# Altium schematic sheet batt_protection.SchDoc: Battery Protection
size A4; Organization: Badgerloop; Address1: 133 Engineering Research; Address2: Building; Address3: Madison, WI 53715; SheetNumber: 17
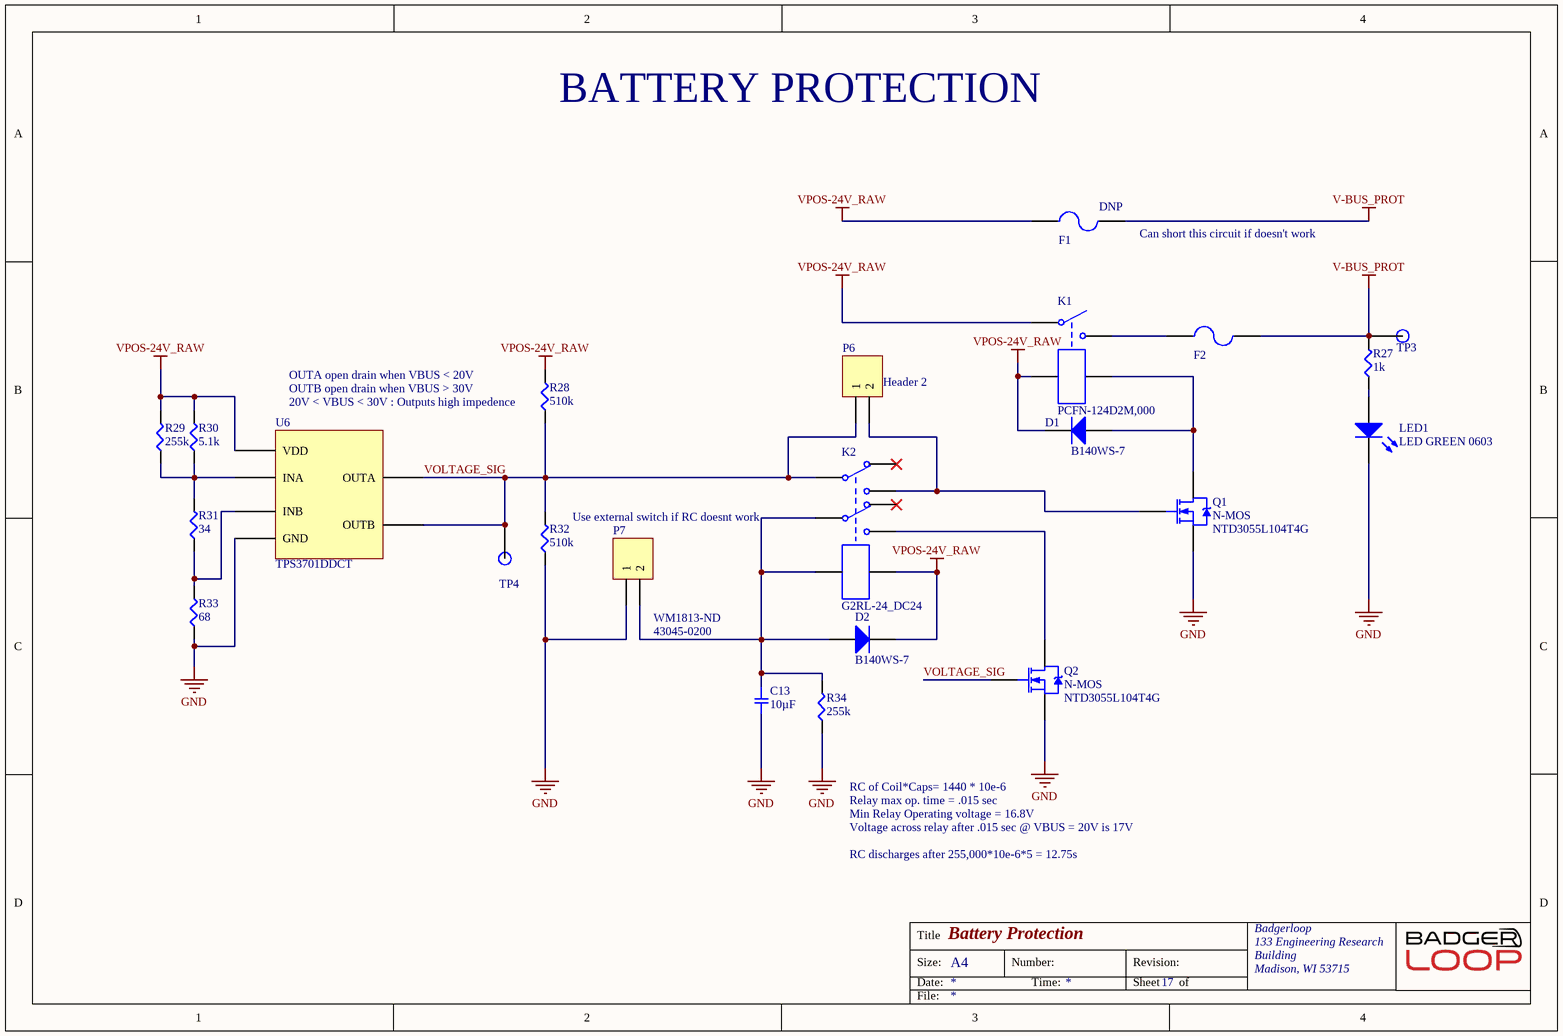
[diagram p0: batt_protection.SchDoc]

## Parts
C13  10µF  [SMD-1206C]
D1  B140WS-7  [SODFL250X110-2N]
D2  B140WS-7  [SODFL250X110-2N]
F1  3568  [Fuse Holder 30A 500V 1 Circuit Blade Through Hole]  (value not drawn)
F2  3568  [Fuse Holder 30A 500V 1 Circuit Blade Through Hole]  (value not drawn)
K1  PCFN-124D2M,000  [PCFN-124D2M,000]
K2  G2RL-24_DC24  [G2RL]
LED1  LED GREEN 0603  [LED 0603 GREEN]
P6  Header 2  [Pin Header 1x2 TH Pitch 2.54mm]
P7  43045-0200  Supplier Part Number 1: WM1813-ND  [430450200]
Q1  N-MOS  Manufacturer P/N: NTD3055L104T4G  [DPAK228P991X238-3N]
Q2  N-MOS  Manufacturer P/N: NTD3055L104T4G  [DPAK228P991X238-3N]
R27  1k  [SMD-0805-RES]
R28  510k  [SMD-0805-RES]
R29  255k  [SMD-0805-RES]
R30  5.1k  [SMD-0805-RES]
R31  34  [SMD-0805-RES]
R32  510k  [SMD-0805-RES]
R33  68  [SMD-0805-RES]
R34  255k  [SMD-0805-RES]
TP3  TP  [Test Point]  (value not drawn)
TP4  TP  [Test Point]  (value not drawn)
U6  TPS3701DDCT  [TSOP95P280X110-6N]

## Nets
GND: C13.2 LED1.2(K) P7.1 Q1.3(S) Q2.3(S) R32.1 R33.1 R34.1 U6.2(GND)
V-BUS_PROT: F1.2 F2.2 R27.2 TP3.1
VPOS-24V_RAW: D1.2(K) D2.2(K) F1.1 K1.1 K1.3 K2.8 R28.2 R29.2 R30.2 U6.5(VDD)
VOLTAGE_SIG: K2.3 P6.1 Q2.1(G) R28.1 R32.2 TP4.1 U6.1(OUTA) U6.6(OUTB)
NetC13_1: C13.1 D2.1(A) K2.1 K2.6 P7.2 R34.2
NetD1_1: D1.1(A) K1.2 Q1.4(D)
NetF2_1: F2.1 K1.4
NetK2_4: K2.4 P6.2 Q1.1(G)
NetK2_5: K2.5 Q2.4(D)
NetLED1_1: LED1.1(A) R27.1
NetR29_1: R29.1 R30.1 R31.2 U6.3(INA)
NetR31_1: R31.1 R33.2 U6.4(INB)

Not connected (* = marked no-connect by the designer): K2 2* 7*

## Notes on the sheet
- BATTERY PROTECTION
- (near F1) Can short this circuit if doesn't work
- OUTA open drain when VBUS < 20V
- OUTB open drain when VBUS > 30V
- (near R28) 20V < VBUS < 30V : Outputs high impedence
- (near R32) Use external switch if RC doesnt work
- RC of Coil*Caps= 1440 * 10e-6
- Relay max op. time = .015 sec
- Voltage across relay after .015 sec @ VBUS = 20V is 17V
- Min Relay Operating voltage = 16.8V
- RC discharges after 255,000*10e-6*5 = 12.75s
- Title
- Size:
- Date:
- A4
- Number:
- Time:
- Revision:
- Sheet
- of
- File:

## Library data of the parts
C13 = GRM31CR61H106KA12L: CAP CER 10UF 50V X5R 1206; Manufacturer: Murata Electronics North America; Factory Stock: 0; Unit Price (USD): 0.65; Minimum Quantity: 1; Tolerance: ±10%; Datasheets: http://www.murata.com/~/media/webrenewal/support/library/catalog/products/capacitor/mlcc/c02e.pdf; Image: //media.digikey.com/Renders/Murata%20Renders/GR331BD72E473KW01L.jpg; Digi-Key Part Number: 490-5961-1-ND; Part Number: GRM31CR61H106KA12L; Quantity Available: 86736; @ qty: 0; Packaging: Cut Tape (CT); Series: GRM; Part Status: Active; Value: 10µF; Voltage: 50V; Temperature Coefficient: X5R; Operating Temperature: -55°C ~ 85°C; Features: -; Ratings: -; Applications: General Purpose; Mounting Type: Surface Mount, MLCC; Package / Case: 1206 (3216 Metric); Size / Dimension: 0.126" L x 0.063" W (3.20mm x 1.60mm); Height - Seated (Max): -; Thickness (Max): 0.071" (1.80mm); Lead Spacing: -; Lead Style: -
D1 D2 = B140WS-7: Diode Schottky 40V 1A 2-Pin SOD-323 T/R; Manufacturer: Diodes; Max Reverse Current: 50uA; Peak Non-Repetitive Surge Current: 3A; Element Configuration: Single; Forward Voltage: 620mV; Natural Thermal Resistance: 426°C/W; Supplier 1: Digi-Key; Stock 1: 38792; Pricing 1: 1=0.41, 10=0.293, 100=0.1476, 500=0.13076, 1000=0.10176 (USD); Mount: Surface Mount; Number of Pins: 2; Weight: 0.000173oz; Contact Plating: Tin,Matte; Min Operating Temperature: -40°C; Max Operating Temperature: 125°C; Forward Current: 1A; Max Repetitive Reverse Voltage (Vrrm): 40V; Package Quantity: 3000; Packaging: Tape and Reel; Average Rectified Current: 1A; Max Forward Surge Current (Ifsm): 3A; Max Reverse Voltage (DC): 40V; Series: -; Length: 1.8mm; Width: 1.4mm; Height: 1.1mm; RoHS Compliant: Yes; ComponentLink1URL: http://www.mouser.com/ds/2/115/ds31543-56649.pdf?src-supplier=Mouser; ComponentLink1Description: http://www.mouser.com/ds/2/115/ds31543-56649.pdf?src-supplier=Mouser; ComponentLink2URL: http://www.diodes.com//datasheets/ds31543.pdf?src-supplier=Avnet+Europe; ComponentLink2Description: http://www.diodes.com//datasheets/ds31543.pdf?src-supplier=Avnet+Europe; ComponentLink3URL: http://www.diodes.com/datasheets/ds31543.pdf?src-supplier=Digi-Key; ComponentLink3Description: http://www.diodes.com/datasheets/ds31543.pdf?src-supplier=Digi-Key; Supplier Part Number 1: B140WS-7DICT-ND
F1 F2 = 3568: FUSE HOLDER MINI AUTO PC; Manufacturer: Keystone Electronics; Material: Brass,Tin,Nylon; Color: Black; Body Material: Nylon; Current Rating: 20A; Voltage Rating (AC): 500V; Number of Poles: 1; Illumination Type: Illuminated; Fuse Type: Automotive; Approvals: UL; Supplier 1: Digi-Key; Manufacturer Part Number: 3568; Stock 1: 0; Mount: PCB,Vertical; Contact Material: Brass,Tin; Contact Plating: Tin; Min Operating Temperature: -50°C; Max Operating Temperature: 145°C; Package Quantity: 1; Termination: PC Pin; Orientation: Vertical; Number of Circuits: 1; Voltage: 500V; Fuse Current: 20A; Length: 16mm; Depth: 6.73mm; Lead Free: Lead Free; REACH SVHC: No SVHC; Flammability Rating: UL94 V-0; ComponentLink1URL: http://www.keyelco.com/userAssets/file/M60-2p40.pdf?src-supplier=Future+Electronics; ComponentLink1Description: http://www.keyelco.com/userAssets/file/M60-2p40.pdf?src-supplier=Future+Electronics; ComponentLink2URL: https://www.alliedelec.com/m/d/15b4f09b8ba48c4b08efedd730709c21.pdf?src-supplier=Allied+Electronics; ComponentLink2Description: https://www.alliedelec.com/m/d/15b4f09b8ba48c4b08efedd730709c21.pdf?src-supplier=Allied+Electronics; Supplier Part Number 1: 3568K-ND
  F1: DNP: DNP
K1 = PCFN-124D2M,000: RELAY, PCB, SPST-NO, 24VDC, 25A; Manufacturer: TE Connectivity; Coil Current: 37.5mA; Throw Configuration: SPST; Coil Resistance: 640R; Operate Time: 20ms; Release Time: 10ms; Coil Power: 1W; Relay Type: General Purpose; Coil Type: Non-Latching; Coil Voltage (DC): 24V; Contact Voltage Rating (AC): 277V; Approvals: UL,VDE; Supplier 1: Digi-Key; Stock 1: 401; Pricing 1: 1=3.7, 10=3.473, 25=3.0872, 50=2.9326, 100=2.7783, 250=2.4696, 500=2.31526, 1000=2.1609 (USD); Mount: Through Hole,PCB; Weight: 28g; Contact Material: Tin,Silver; Min Operating Temperature: -30°C; Max Operating Temperature: 55°C; Contact Current Rating: 25A; Termination: PCB; Package Quantity: 500; Packaging: Rail/Tube; Current Rating: 25A; Voltage Rating (DC): 24V; Length: 30.4mm; Height: 1.043inch; Depth: 16mm; Width: 0.63inch; REACH SVHC: Unknown; ELV: Compliant; ComponentLink1URL: http://www.farnell.com/cad/1652771.pdf?src-supplier=Element14; ComponentLink1Description: http://www.farnell.com/cad/1652771.pdf?src-supplier=Element14; ComponentLink2URL: http://www.farnell.com/datasheets/2043483.pdf?src-supplier=Farnell; ComponentLink2Description: http://www.farnell.com/datasheets/2043483.pdf?src-supplier=Farnell; Supplier Part Number 1: PB2178-ND; ComponentLink3Description: https://www.te.com/commerce/DocumentDelivery/DDEController?Action=srchrtrv&DocNm=PCFN_solar_relay_datasheet&DocType=DS&DocLang=English; ComponentLink3URL: https://www.te.com/commerce/DocumentDelivery/DDEController?Action=srchrtrv&DocNm=PCFN_solar_relay_datasheet&DocType=DS&DocLang=English
K2 = G2RL-24_DC24: RELAY GEN PURPOSE DPDT 8A 24V; Manufacturer: Omron; Manufacturer Part Number: G2RL-24-DC24; Voltage Rating (AC): 440V; Voltage Rating (DC): 300V; Power Consumption: 400mW; Coil Resistance: 1.44kR; Coil Current: 16.7mA; Operate Time: 15ms; Coil Type: Non-Latching; Relay Type: General Purpose; Release Time: 5ms; Supplier 1: Digi-Key; Stock 1: 13387; Pricing 1: 1=4.32, 10=4.053, 25=3.6028, 50=3.4226, 100=3.2425, 250=2.88224, 500=2.7021 (USD); Mount: Through Hole; Case/Package: DIP; Number of Pins: 8; Weight: 12g; Contact Material: Silver,Cadmium; Min Operating Temperature: -40°C; Max Operating Temperature: 85°C; Max Current Rating: 8A; Packaging: Bulk; Max Voltage Rating (AC): 440V; Max Voltage Rating (DC): 300V; Package Quantity: 20; Throw Configuration: DPDT; Termination: PC Pin; Contact Current Rating: 8A; Coil Voltage (DC): 24V; Coil Power: 400mW; Power Rating: 400mW; Length: 29mm; Height: 15.7mm; Width: 12.7mm; Depth: 12.7mm; Radiation Hardening: No; Lead Free: Lead Free; ComponentLink1URL: http://www.alliedelec.com/images/products/datasheets/bm/OMRON_ELECTRONICS_LLC/70175264.pdf?src-supplier=Allied+Electronics; ComponentLink1Description: http://www.alliedelec.com/images/products/datasheets/bm/OMRON_ELECTRONICS_LLC/70175264.pdf?src-supplier=Allied+Electronics; ComponentLink2URL: http://www.mouser.com/ds/2/307/en-g2rl-472571.pdf?src-supplier=Mouser; ComponentLink2Description: http://www.mouser.com/ds/2/307/en-g2rl-472571.pdf?src-supplier=Mouser
LED1 = LED GREEN 0603: Manufacturer: Lite-On Inc.; Manufacturer P/N: LTST-C190KGKT; Digikey P/N: 160-1435-1-ND; Package / Case: 0603; Color: GREEN
P6 = Header 2: Header, 2-Pin; LatestRevisionDate: 17-Jul-2002; LatestRevisionNote: Re-released for DXP Platform.; Publisher: Altium Limited
P7 = 43045-0200: CONN HEADER R/A 2POS; Manufacturer: Molex; Contact Resistance: 10mR; Number of Contacts: 2; Voltage Rating: 600V; Current Rating: 5A; Gender: Male; Max Voltage Rating (DC): 250.25kV; Voltage Rating (DC): 250V; Insulation Resistance: 1GR; Pitch: 3mm; Glow Wire Compliant: Compliant; Approvals: UL,CSA,TUV; Supplier 1: Digi-Key; Manufacturer Part Number: 43045-0200; Stock 1: 6320; Pricing 1: 1=0.97000, 10=0.84900, 100=0.73280, 500=0.59958, 1000=0.53296, 5000=0.46634, 10000=0.44302 (USD); RoHS: Yes; Mount: Through Hole; Case/Package: SMC; Contact Plating: Tin; Color: Black; Contact Material: Brass,Tin; Housing Color: Black; Housing Material: Thermoplastic; Material: Thermoplastic; Min Operating Temperature: -40°C; Max Operating Temperature: 105°C; Termination: Through Hole; Number of Rows: 2; Orientation: Right Angle; Packaging: Tray; Number of Positions: 2; Package Quantity: 3168; Number of Circuits: 2; Contact Gender: Male; Diameter: 3mm; Row Spacing: 3mm; Radiation Hardening: No; Flammability Rating: UL94 V-0; REACH SVHC: Unknown; Lead Free: Lead Free; Halogen Free: Low Halogen; ComponentLink1URL: https://datasheet.ciiva.com/14155/04402310-14155203.pdf?src-supplier=Distrelec; ComponentLink1Description: https://datasheet.ciiva.com/14155/04402310-14155203.pdf?src-supplier=Distrelec; ComponentLink2URL: https://datasheet.ciiva.com/19454/883270-19454006.pdf?src-supplier=Jameco; ComponentLink2Description: https://datasheet.ciiva.com/19454/883270-19454006.pdf?src-supplier=Jameco; ComponentLink3URL: https://datasheet.ciiva.com/5150/0430450200-pcb-headers-145770-5150407.pdf?src-supplier=Mouser; ComponentLink3Description: https://datasheet.ciiva.com/5150/0430450200-pcb-headers-145770-5150407.pdf?src-supplier=Mouser; ComponentLink4URL: https://datasheet.ciiva.com/11747/0900766b80027348-11747001.pdf?src-supplier=RSComponents; ComponentLink4Description: https://datasheet.ciiva.com/11747/0900766b80027348-11747001.pdf?src-supplier=RSComponents; ComponentLink5URL: https://datasheet.ciiva.com/16656/0430450200-pcb-headers-16656330.pdf?src-supplier=Avnet+Europe; ComponentLink5Description: https://datasheet.ciiva.com/16656/0430450200-pcb-headers-16656330.pdf?src-supplier=Avnet+Europe; ComponentLink6URL: https://datasheet.ciiva.com/10090/0430450200-pcb-headers-10090299.pdf?src-supplier=Avnet; ComponentLink6Description: https://datasheet.ciiva.com/10090/0430450200-pcb-headers-10090299.pdf?src-supplier=Avnet; ComponentLink7URL: https://datasheet.ciiva.com/36854/124280430450200-pcb-headers-36854331.pdf?src-supplier=Onlinecomponents.com; ComponentLink7Description: https://datasheet.ciiva.com/36854/124280430450200-pcb-headers-36854331.pdf?src-supplier=Onlinecomponents.com; ComponentLink8URL: https://datasheet.ciiva.com/1443/1859921-1443437.pdf?src-supplier=Element14; ComponentLink8Description: https://datasheet.ciiva.com/1443/1859921-1443437.pdf?src-supplier=Element14
Q1 Q2 = N-MOS: N-Channel Power MOSFET, 12 A, 60 V; Manufacturer: ON SEMI; Digikey Link: https://www.digikey.com/product-detail/en/on-semiconductor/NTD3055L104T4G/NTD3055L104T4GOSDKR-ND/1749196; Digikey P/N: NTD3055L104T4GOSDKR-ND
R27 = ERJ-P06J102V: RES SMD 1K OHM 5% 1/2W 0805; Manufacturer: Panasonic Electronic Components; Factory Stock: 0; Unit Price (USD): 0.01839; @ qty: 1500; Minimum Quantity: 1; Power (Watts): 0.5W, 1/2W; Temperature Coefficient: ±200ppm/°C; Part Number: ERJ-P06J102V; Datasheets: https://industrial.panasonic.com/cdbs/www-data/pdf/RDA0000/AOA0000C243.pdf; Image: //media.digikey.com/Renders/Panasonic%20Renders/ERJ-0805%20Pkg.jpg; Digi-Key Part Number: P1.0KADCT-ND; Quantity Available: 124757; Packaging: Cut Tape (CT); Series: ERJ; Part Status: Active; Value: 1k; Tolerance: ±5%; Composition: Thick Film; Features: Automotive AEC-Q200, Pulse Withstanding; Operating Temperature: -55°C ~ 155°C; Package / Case: 0805 (2012 Metric); Supplier Device Package: 0805; Size / Dimension: 0.079" L x 0.049" W (2.00mm x 1.25mm); Height - Seated (Max): 0.028" (0.70mm); Number of Terminations: 2; Failure Rate: -
R28 R32 = ERJ-6ENF5103V: RES SMD 510K OHM 1% 1/8W 0805; Manufacturer: Panasonic Electronic Components; Factory Stock: 0; Unit Price (USD): 0.00729; @ qty: 1500; Minimum Quantity: 1; Power (Watts): 0.125W, 1/8W; Temperature Coefficient: ±100ppm/°C; Part Number: ERJ-6ENF5103V; Datasheets: http://industrial.panasonic.com/www-cgi/jvcr13pz.cgi?E+PZ+3+AOA0002+ERJ6ENF5103V+7+WW; Image: //media.digikey.com/Renders/Panasonic%20Renders/ERJ-0805%20Pkg.jpg; Digi-Key Part Number: P510KCCT-ND; Quantity Available: 23343; Packaging: Cut Tape (CT); Series: ERJ; Part Status: Active; Value: 510k; Tolerance: ±1%; Composition: Thick Film; Features: Automotive AEC-Q200; Operating Temperature: -55°C ~ 155°C; Package / Case: 0805 (2012 Metric); Supplier Device Package: 0805; Size / Dimension: 0.079" L x 0.049" W (2.00mm x 1.25mm); Height - Seated (Max): 0.028" (0.70mm); Number of Terminations: 2; Failure Rate: -
R29 R34 = ERJ-6ENF2553V: RES SMD 255K OHM 1% 1/8W 0805; Manufacturer: Panasonic Electronic Components; Factory Stock: 0; Unit Price (USD): 0.00729; @ qty: 1500; Minimum Quantity: 1; Power (Watts): 0.125W, 1/8W; Temperature Coefficient: ±100ppm/°C; Part Number: ERJ-6ENF2553V; Datasheets: http://industrial.panasonic.com/www-cgi/jvcr13pz.cgi?E+PZ+3+AOA0002+ERJ6ENF2553V+7+WW; Image: //media.digikey.com/Renders/Panasonic%20Renders/ERJ-0805%20Pkg.jpg; Digi-Key Part Number: P255KCCT-ND; Quantity Available: 49587; Packaging: Cut Tape (CT); Series: ERJ; Part Status: Active; Value: 255k; Tolerance: ±1%; Composition: Thick Film; Features: Automotive AEC-Q200; Operating Temperature: -55°C ~ 155°C; Package / Case: 0805 (2012 Metric); Supplier Device Package: 0805; Size / Dimension: 0.079" L x 0.049" W (2.00mm x 1.25mm); Height - Seated (Max): 0.028" (0.70mm); Number of Terminations: 2; Failure Rate: -
R30 = ERJ-6ENF5101V: RES SMD 5.1K OHM 1% 1/8W 0805; Manufacturer: Panasonic Electronic Components; Factory Stock: 0; Unit Price (USD): 0.00729; @ qty: 1500; Minimum Quantity: 1; Power (Watts): 0.125W, 1/8W; Temperature Coefficient: ±100ppm/°C; Part Number: ERJ-6ENF5101V; Datasheets: http://industrial.panasonic.com/www-cgi/jvcr13pz.cgi?E+PZ+3+AOA0002+ERJ6ENF5101V+7+WW; Image: //media.digikey.com/Renders/Panasonic%20Renders/ERJ-0805%20Pkg.jpg; Digi-Key Part Number: P5.10KCCT-ND; Quantity Available: 74332; Packaging: Cut Tape (CT); Series: ERJ; Part Status: Active; Value: 5.1k; Tolerance: ±1%; Composition: Thick Film; Features: Automotive AEC-Q200; Operating Temperature: -55°C ~ 155°C; Package / Case: 0805 (2012 Metric); Supplier Device Package: 0805; Size / Dimension: 0.079" L x 0.049" W (2.00mm x 1.25mm); Height - Seated (Max): 0.028" (0.70mm); Number of Terminations: 2; Failure Rate: -
R31 = ERJ-6ENF34R0V: RES SMD 34 OHM 1% 1/8W 0805; Manufacturer: Panasonic Electronic Components; Factory Stock: 0; Unit Price (USD): 0.00729; @ qty: 1500; Minimum Quantity: 1; Power (Watts): 0.125W, 1/8W; Temperature Coefficient: ±100ppm/°C; Part Number: ERJ-6ENF34R0V; Datasheets: http://industrial.panasonic.com/www-cgi/jvcr13pz.cgi?E+PZ+3+AOA0002+ERJ6ENF34R0V+7+WW; Image: //media.digikey.com/Renders/Panasonic%20Renders/ERJ-0805%20Pkg.jpg; Digi-Key Part Number: P34.0CCT-ND; Quantity Available: 49762; Packaging: Cut Tape (CT); Series: ERJ; Part Status: Active; Value: 34; Tolerance: ±1%; Composition: Thick Film; Features: Automotive AEC-Q200; Operating Temperature: -55°C ~ 155°C; Package / Case: 0805 (2012 Metric); Supplier Device Package: 0805; Size / Dimension: 0.079" L x 0.049" W (2.00mm x 1.25mm); Height - Seated (Max): 0.028" (0.70mm); Number of Terminations: 2; Failure Rate: -
R33 = ERJ-6ENF68R0V: RES SMD 68 OHM 1% 1/8W 0805; Manufacturer: Panasonic Electronic Components; Factory Stock: 0; Unit Price (USD): 0.00729; @ qty: 1500; Minimum Quantity: 1; Power (Watts): 0.125W, 1/8W; Temperature Coefficient: ±100ppm/°C; Part Number: ERJ-6ENF68R0V; Datasheets: http://industrial.panasonic.com/www-cgi/jvcr13pz.cgi?E+PZ+3+AOA0002+ERJ6ENF68R0V+7+WW; Image: //media.digikey.com/Renders/Panasonic%20Renders/ERJ-0805%20Pkg.jpg; Digi-Key Part Number: P68.0CCT-ND; Quantity Available: 47206; Packaging: Cut Tape (CT); Series: ERJ; Part Status: Active; Value: 68; Tolerance: ±1%; Composition: Thick Film; Features: Automotive AEC-Q200; Operating Temperature: -55°C ~ 155°C; Package / Case: 0805 (2012 Metric); Supplier Device Package: 0805; Size / Dimension: 0.079" L x 0.049" W (2.00mm x 1.25mm); Height - Seated (Max): 0.028" (0.70mm); Number of Terminations: 2; Failure Rate: -
TP3 TP4 = TP: SMD TEST POINT
U6 = TPS3701DDCT: IC COMP WINDOW W/REF 6SOT; Manufacturer: Texas Instruments; Min Supply Voltage: 1.8V; Max Supply Voltage: 36V; Number of Elements: 1; Quiescent Current: 11uA; Propagation Delay: 28.1us; Hysteresis: 5.5mV; Response Time: 155us; Supplier 1: Digi-Key; Stock 1: 2174; Pricing 1: 1=2.74, 10=2.459, 25=2.32, 100=1.8561 (USD); Mount: Surface Mount; Case/Package: SOT-23-6; Number of Pins: 6; Min Operating Temperature: -40°C; Max Operating Temperature: 125°C; Packaging: Tape and Reel; REACH SVHC: No SVHC; Lead Free: Lead Free; ComponentLink1URL: http://www.ti.com/general/docs/lit/getliterature.tsp?genericPartNumber=TPS3701&amp;&amp;fileType=pdf&src-supplier=Farnell; ComponentLink1Description: http://www.ti.com/general/docs/lit/getliterature.tsp?genericPartNumber=TPS3701&amp;&amp;fileType=pdf&src-supplier=Farnell; ComponentLink2URL: http://www.ti.com/general/docs/lit/getliterature.tsp?genericPartNumber=TPS3701&&fileType=pdf&src-supplier=Element14; ComponentLink2Description: http://www.ti.com/general/docs/lit/getliterature.tsp?genericPartNumber=TPS3701&&fileType=pdf&src-supplier=Element14; ComponentLink3URL: http://www.ti.com/lit/ds/symlink/tps3701.pdf?src-supplier=Digi-Key; ComponentLink3Description: http://www.ti.com/lit/ds/symlink/tps3701.pdf?src-supplier=Digi-Key; ComponentLink4URL: http://www.ti.com/general/docs/lit/getliterature.tsp?genericPartNumber=TPS3701&&fileType=pdf&src-supplier=Avnet; ComponentLink4Description: http://www.ti.com/general/docs/lit/getliterature.tsp?genericPartNumber=TPS3701&&fileType=pdf&src-supplier=Avnet; ComponentLink5URL: http://www.ti.com/lit/gpn/tps3701?src-supplier=Mouser; ComponentLink5Description: http://www.ti.com/lit/gpn/tps3701?src-supplier=Mouser; Supplier Part Number 1: 296-38622-1-ND